# EasyEDA schematic No Internet Game Robot_2021-07-26.json
TITLE: No Internet Game Robot; REV: 1.0; Date: 2021-07-26; Sheet: 1/1; Drawn By: GogiPuttar; Company: Aditya Nair
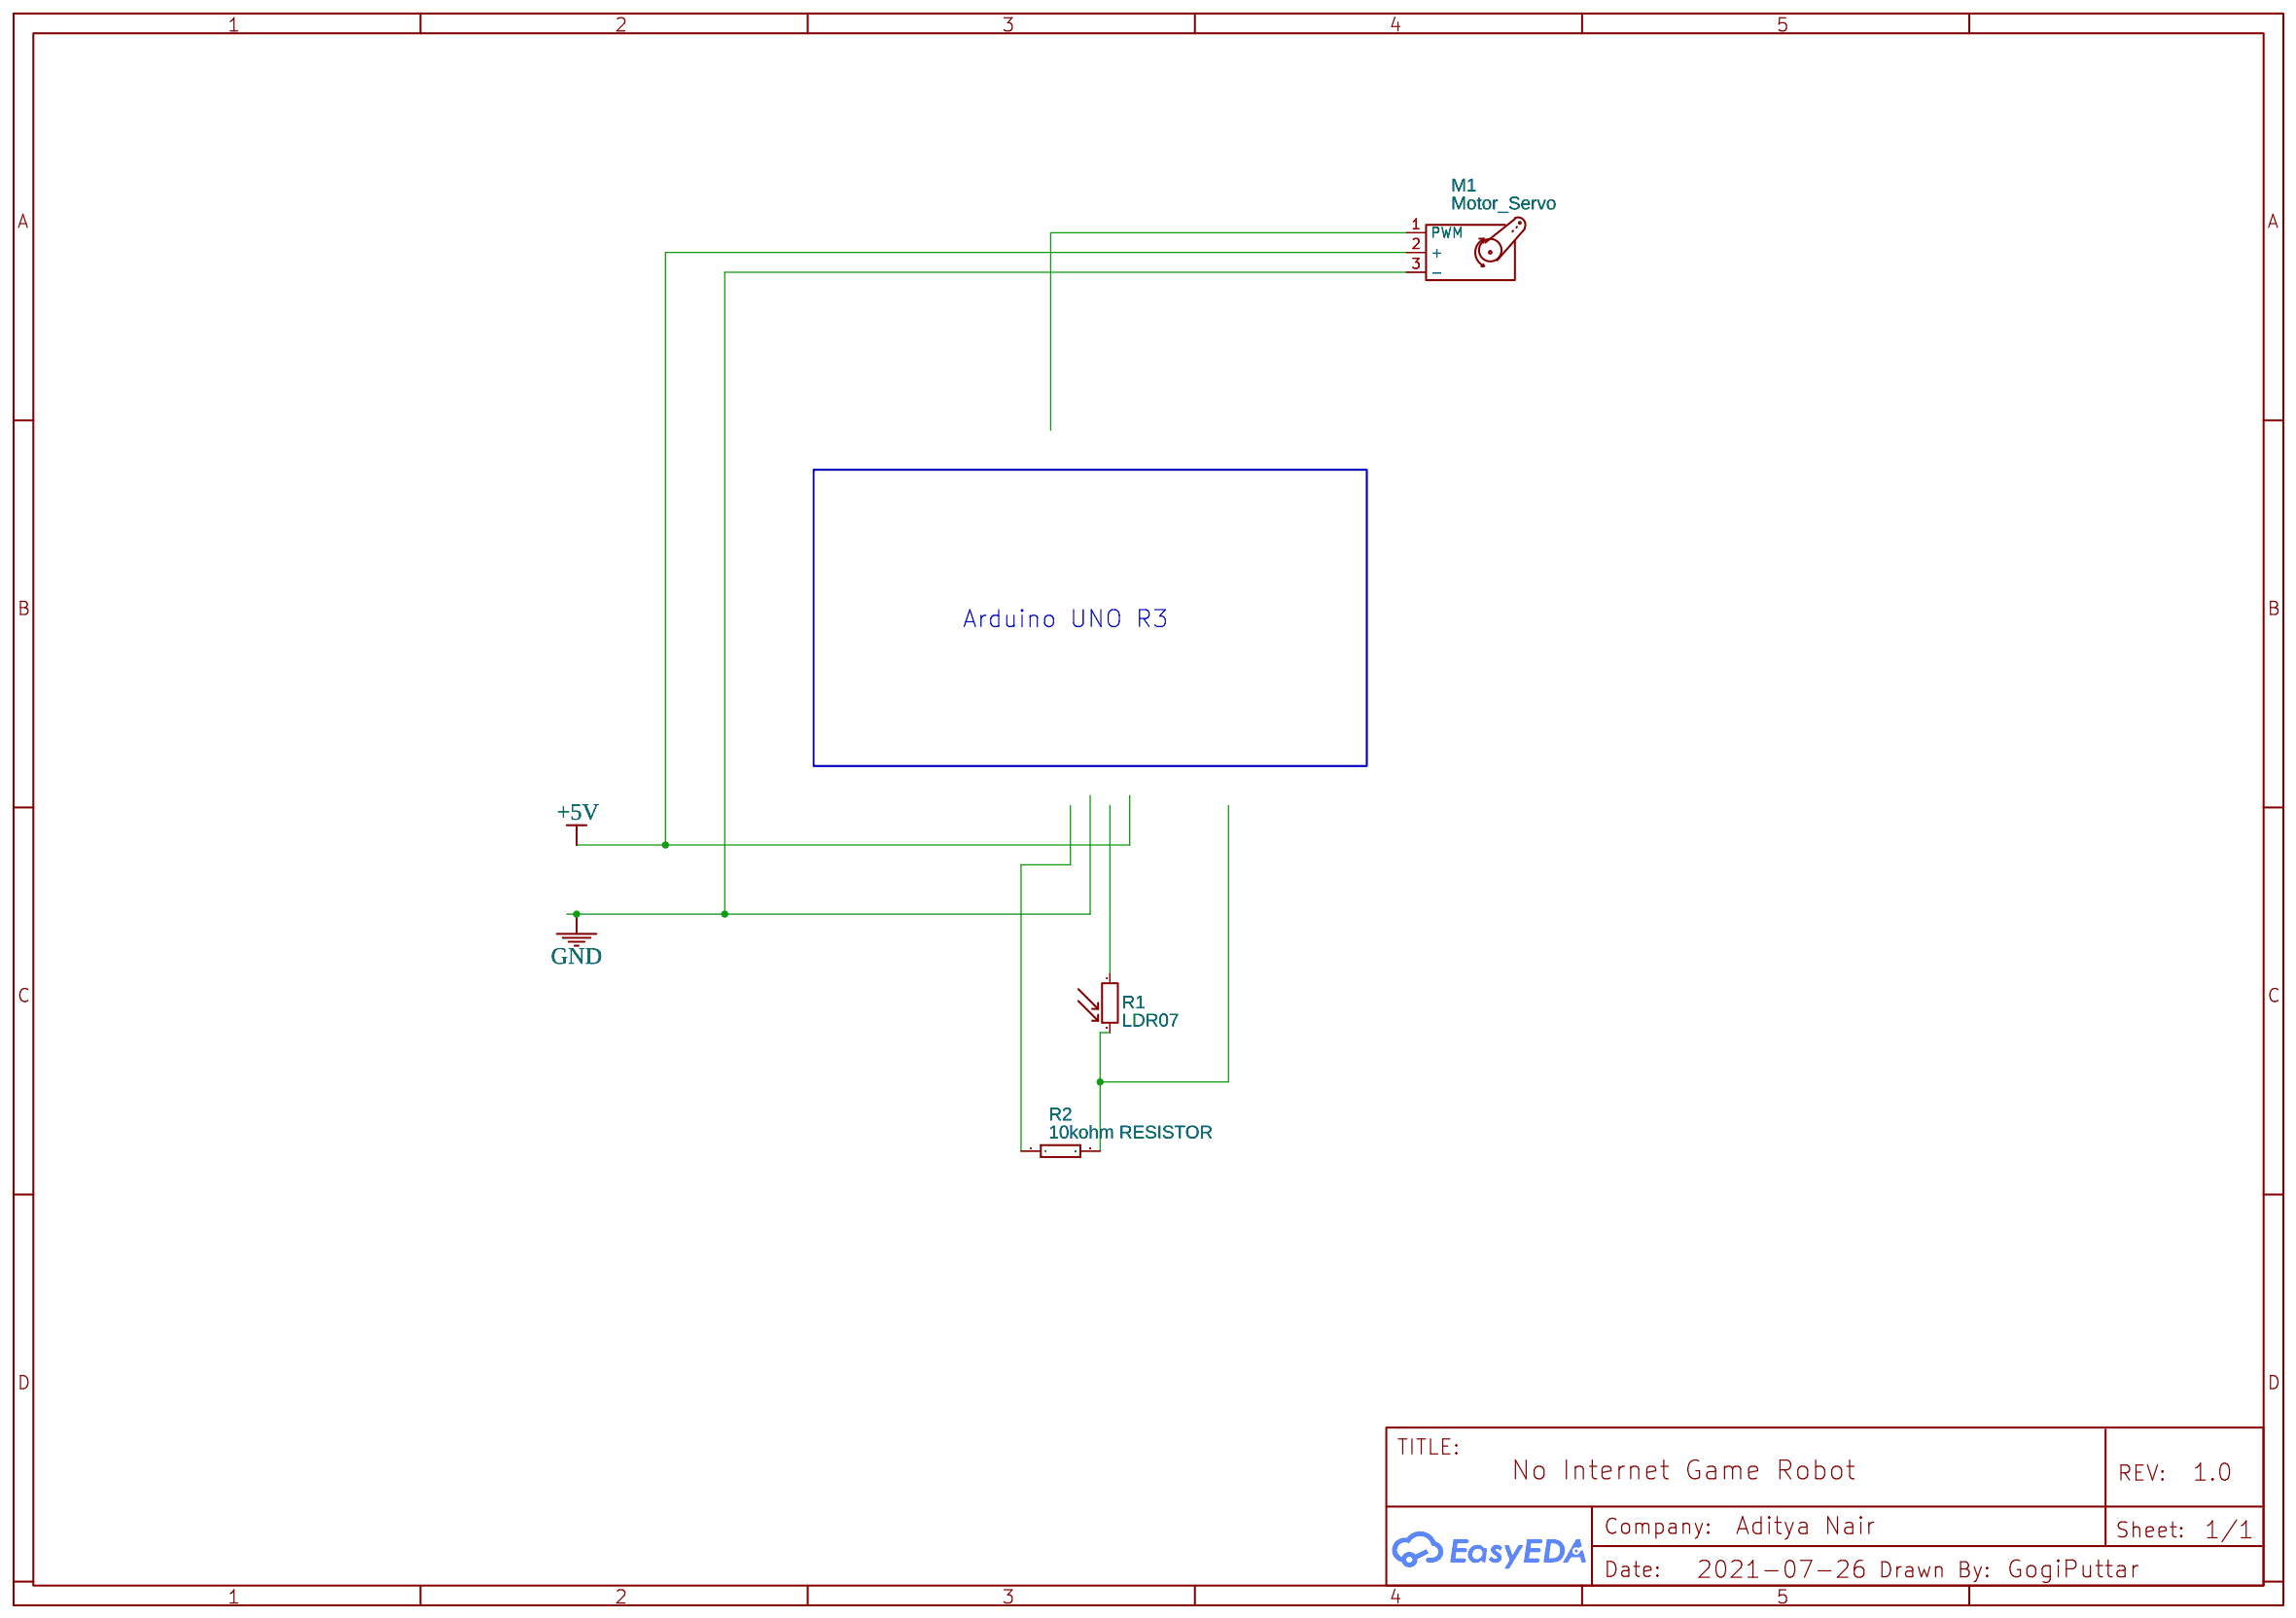
[diagram p0: schematic sheet]

## Parts
M1  Motor_Servo
R1  LDR07  [RESISTOR_LDR_5.1X4.3_RM3.4]
R2  10kohm RESISTOR  [RTH025W]

## Library data of the parts
M1 = Motor_Servo: Contributor: KiCAD; license: https://www.gnu.org/licenses/lgpl-2.1.html
R1 = LDR07: Contributor: KiCAD; license: https://www.gnu.org/licenses/lgpl-2.1.html
R2 = RESISTOR: Contributor: DangerousPrototype

## Nets
+5V: M1.2(+)
GND: M1.3(-)
Net-(R1-2): R1.2 R2.2

Not connected (* = marked no-connect by the designer): M1 1(PWM); R1 1; R2 1

## Notes on the sheet
- Arduino UNO R3
